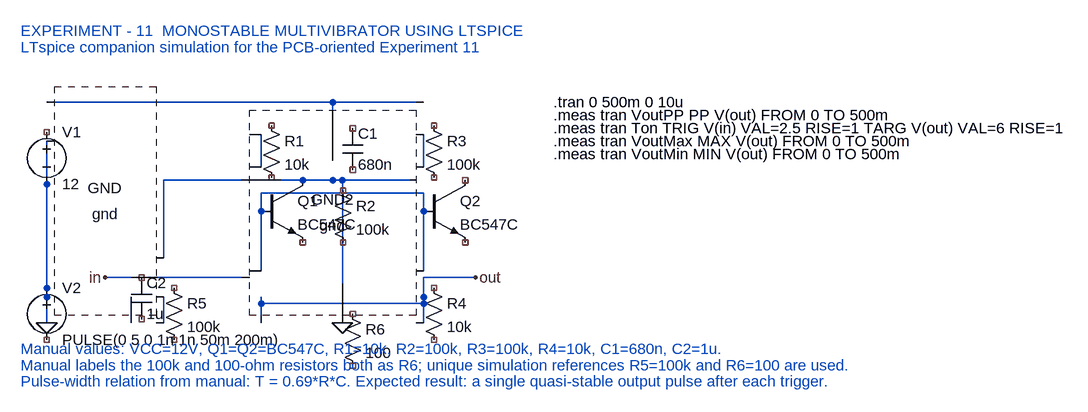
[diagram p0: schematic ECA0411_LTSpice_Monostable_Multivibrator.asc]
ECA0411_LTSpice_Monostable_Multivibrator.asc, the LTspice schematic file:
Version 4
SHEET 1 1200 800
FLAG 210 500 in
FLAG 780 500 out
FLAG 120 570 0
FLAG 575 570 0
SYMBOL voltage 120 260 R0
SYMATTR InstName V1
SYMATTR Value 12
SYMBOL voltage 120 500 R0
SYMATTR InstName V2
SYMATTR Value PULSE(0 5 0 1n 1n 50m 200m)
SYMATTR SpiceLine AC 1
SYMBOL npn 450 350 R0
SYMATTR InstName Q1
SYMATTR Value BC547C
SYMBOL npn 700 350 R0
SYMATTR InstName Q2
SYMATTR Value BC547C
SYMBOL res 450 250 R0
SYMATTR InstName R1
SYMATTR Value 10k
SYMBOL res 700 250 R0
SYMATTR InstName R3
SYMATTR Value 100k
SYMBOL res 700 500 R0
SYMATTR InstName R4
SYMATTR Value 10k
SYMBOL res 560 350 R0
SYMATTR InstName R2
SYMATTR Value 100k
SYMBOL res 300 500 R0
SYMATTR InstName R5
SYMATTR Value 100k
SYMBOL res 575 540 R0
SYMATTR InstName R6
SYMATTR Value 100
SYMBOL cap 575 270 R0
SYMATTR InstName C1
SYMATTR Value 680n
SYMBOL cap 250 500 R0
SYMATTR InstName C2
SYMATTR Value 1u
SYMBOL gnd 120 570 R0
SYMATTR InstName GND
WIRE 120 230 700 230
WIRE 120 290 120 570
WIRE 120 530 120 570
WIRE 450 280 450 330
WIRE 450 370 450 490
WIRE 450 530 450 540
WIRE 700 280 700 330
WIRE 700 370 700 490
WIRE 700 530 700 540
WIRE 300 470 300 350
WIRE 300 350 420 350
WIRE 480 350 560 350
WIRE 560 350 680 350
WIRE 560 320 560 270
WIRE 560 270 560 230
WIRE 450 370 700 370
WIRE 450 540 575 540
WIRE 700 540 575 540
WIRE 700 530 700 540
WIRE 575 510 575 350
WIRE 575 350 560 350
WIRE 700 530 700 570
WIRE 450 530 450 570
WIRE 300 530 300 570
WIRE 250 530 250 570
WIRE 210 500 250 500
WIRE 290 500 420 500
WIRE 700 500 700 530
WIRE 700 500 780 500
SYMBOL gnd 575 570 R0
SYMATTR InstName GND2
TEXT 80 120 Left 2 EXPERIMENT - 11  MONOSTABLE MULTIVIBRATOR USING LTSPICE
TEXT 80 145 Left 2 LTspice companion simulation for the PCB-oriented Experiment 11
TEXT 80 610 Left 2 Manual values: VCC=12V, Q1=Q2=BC547C, R1=10k, R2=100k, R3=100k, R4=10k, C1=680n, C2=1u.
TEXT 80 635 Left 2 Manual labels the 100k and 100-ohm resistors both as R6; unique simulation references R5=100k and R6=100 are used.
TEXT 80 660 Left 2 Pulse-width relation from manual: T = 0.69*R*C. Expected result: a single quasi-stable output pulse after each trigger.
TEXT 900 230 Left 2 !.tran 0 500m 0 10u
TEXT 900 250 Left 2 !.meas tran VoutPP PP V(out) FROM 0 TO 500m
TEXT 900 270 Left 2 !.meas tran Ton TRIG V(in) VAL=2.5 RISE=1 TARG V(out) VAL=6 RISE=1
TEXT 900 290 Left 2 !.meas tran VoutMax MAX V(out) FROM 0 TO 500m
TEXT 900 310 Left 2 !.meas tran VoutMin MIN V(out) FROM 0 TO 500m

The netlist it stands for:
* ECA0411_LTSpice_Monostable_Multivibrator.asc
V1 NC_01 0 12
V2 0 NC_02 PULSE(0 5 0 1n 1n 50m 200m) AC 1
Q1 N006 N003 NC_03 0 BC547C
Q2 NC_04 N003 NC_05 0 BC547C
R1 NC_06 NC_07 10k
R3 NC_08 NC_09 100k
R4 NC_10 NC_11 10k
R2 NC_12 NC_13 100k
R5 NC_14 NC_15 100k
R6 NC_16 NC_17 100
C1 NC_18 NC_19 680n
C2 NC_20 NC_21 1u
* GND: gnd (symbol gnd not available, pin order unknown); nets seen at it: 0, in, N001, N005, N007, N008, N009
* GND2: gnd (symbol gnd not available, pin order unknown); nets seen at it: 0, N001, N002, N003, N004, N005, N006, N009, out
.model NPN NPN
.model PNP PNP
.lib standard.bjt
* EXPERIMENT - 11  MONOSTABLE MULTIVIBRATOR USING LTSPICE
* LTspice companion simulation for the PCB-oriented Experiment 11
* Manual values: VCC=12V, Q1=Q2=BC547C, R1=10k, R2=100k, R3=100k, R4=10k, C1=680n, C2=1u.
* Manual labels the 100k and 100-ohm resistors both as R6; unique simulation references R5=100k and R6=100 are used.
* Pulse-width relation from manual: T = 0.69*R*C. Expected result: a single quasi-stable output pulse after each trigger.
.tran 0 500m 0 10u
.meas tran VoutPP PP V(out) FROM 0 TO 500m
.meas tran Ton TRIG V(in) VAL=2.5 RISE=1 TARG V(out) VAL=6 RISE=1
.meas tran VoutMax MAX V(out) FROM 0 TO 500m
.meas tran VoutMin MIN V(out) FROM 0 TO 500m
.backanno
.end